# EAGLE design diagrama-esquematico-r00 (EAGLE 8.6.0)
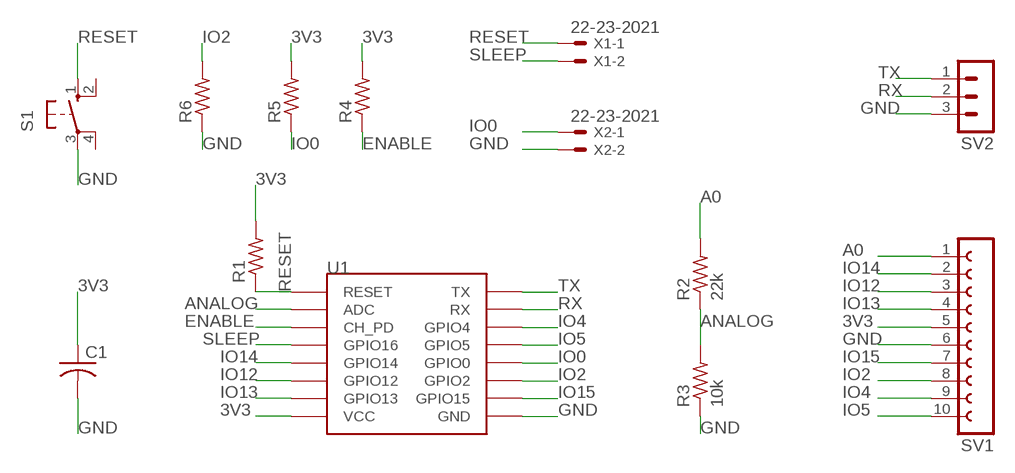
[diagram p0: schematic, sheet 1]

## Parts
C1  C-US025-030X050  [C025-030X050]
R1  R-US_0207/10  [0207/10]
R2  22k  R-US_0207/10  [0207/10]
R3  10k  R-US_0207/10  [0207/10]
R4  R-US_0207/10  [0207/10]
R5  R-US_0207/10  [0207/10]
R6  R-US_0207/10  [0207/10]
S1  10-XX  [B3F-10XX]
SV1  FE10-1  [FE10]
SV2  MA03-1  [MA03-1]
U1  ESP12  [ESP12]
X1  22-23-2021  [22-23-2021]
X2  22-23-2021  [22-23-2021]

## Nets
3V3: C1.1 R1.2 R4.2 R5.2 SV1.5 U1.VCC
A0: R2.2 SV1.1
ANALOG: R2.1 R3.2 U1.ADC
ENABLE: R4.1 U1.CH_PD
GND: C1.2 R3.1 R6.1 S1.3(P) SV1.6 SV2.3 U1.GND X2.2
IO0: R5.1 U1.GPIO0 X2.1
IO2: R6.2 SV1.8 U1.GPIO2
IO4: SV1.9 U1.GPIO4
IO5: SV1.10 U1.GPIO5
IO12: SV1.3 U1.GPIO12
IO13: SV1.4 U1.GPIO13
IO14: SV1.2 U1.GPIO14
IO15: SV1.7 U1.GPIO15
RESET: R1.1 S1.1(S) U1.RESET X1.1
RX: SV2.2 U1.RX
SLEEP: U1.GPIO16 X1.2
TX: SV2.1 U1.TX
Unconnected: S1.2(S1) S1.4(P1)

## Library data of the parts
C1 = rcl:C-US: CAPACITOR, American symbol; SPICEPREFIX: C
R1-R6 = resistor:R-US_: RESISTOR, American symbol
S1 = switch-omron:10-XX: OMRON SWITCH; MPN: B3F-1000; OC_FARNELL: 176432; OC_NEWARK: 36M3542
SV1 = con-lsta:FE10-1: FEMALE HEADER; OC_FARNELL: unknown; OC_NEWARK: unknown
SV2 = con-lstb:MA03-1: PIN HEADER; OC_FARNELL: unknown; OC_NEWARK: unknown
U1 = esp8266modules:ESP12: ESP8266 Wifi module 12
X1 X2 = con-molex:22-23-2021: .100" (2.54mm) Center Header - 2 Pin; MF: MOLEX; MPN: 22-23-2021; OC_FARNELL: 1462926; OC_NEWARK: 25C3832

## Board
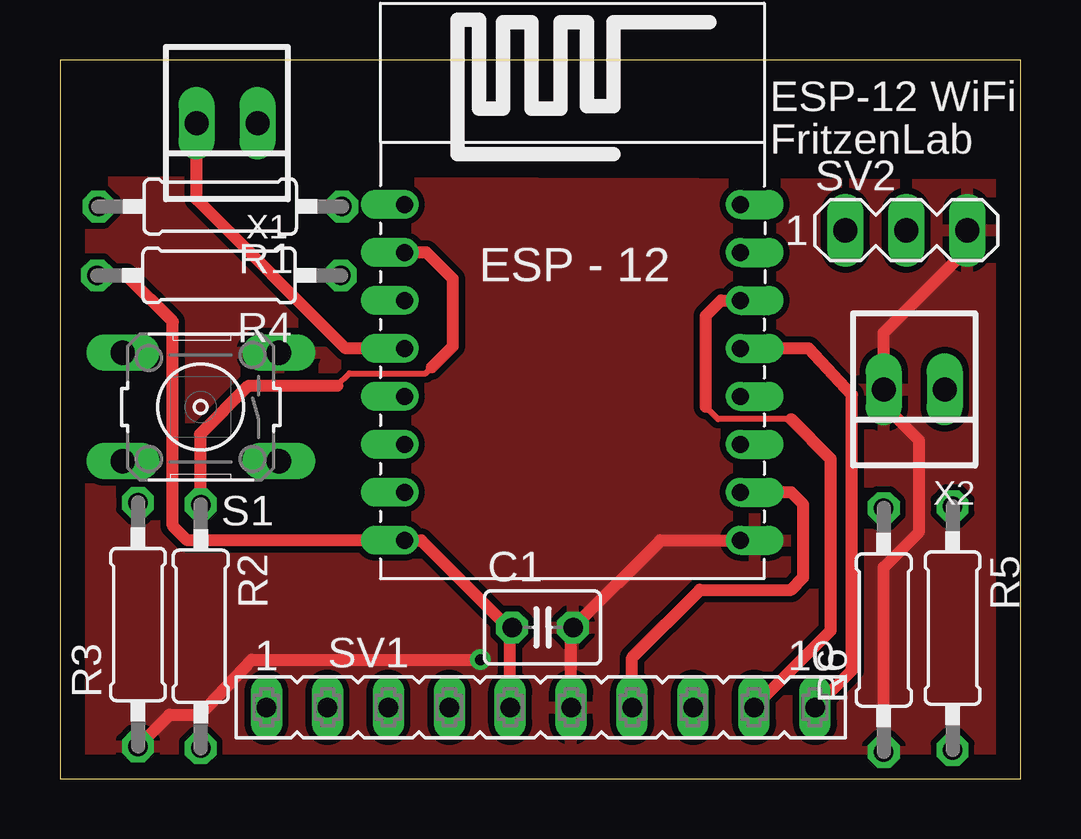
[diagram p1: board, top side]
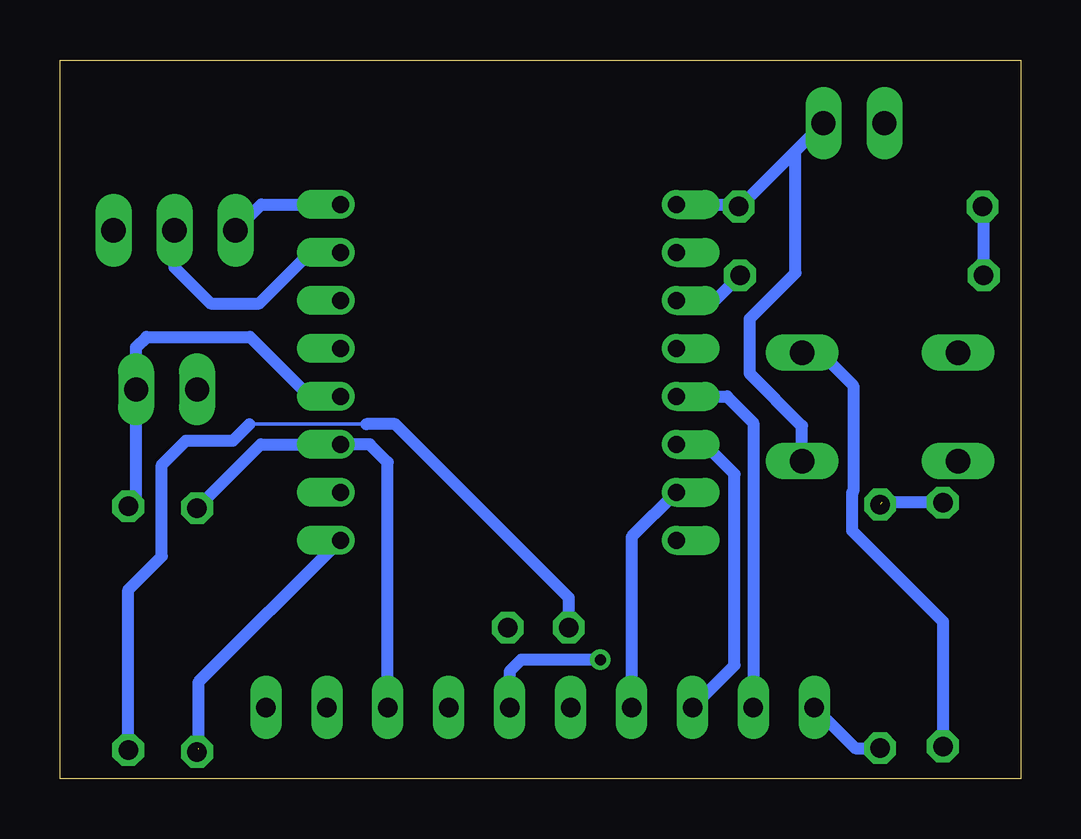
[diagram p2: board, bottom side, seen from below]

Size 40.06 x 29.96 mm. Coordinates in mm from the lower left corner, seen from the top.
Outline: 0,0 40.06,0 40.06,29.96 0,29.96 0,0
Copper layers (1*16): Top 0.035mm / dielectric 1.5mm / Bottom 0.035mm
Design rules "default *": minimum track width 6mil, minimum drill 0.35mm, track to track 10mil, track to pad 10mil, pad to pad 10mil, via to via 10mil, smd to smd 10mil, copper to edge 40mil, drill to drill 6mil, minimum pad ring 10mil, minimum via ring 8mil, stop-mask expansion 4mil, vias tented up to drill 0mil, thermal gap 10mil

### Footprints (pad centres in the part's own frame; a part is rotated, then mirrored left to right if it is on the bottom)
C025-030X050 = drill 0.813 octagon: 1 -1.27,0; 2 1.27,0
0207/10 = drill 0.813 octagon: 1 -5.08,0; 2 5.08,0
B3F-10XX = drill 1.016 long: 1 -3.251,2.261; 2 3.251,2.261; 3 -3.251,-2.261; 4 3.251,-2.261
FE10 = drill 0.813 long: 1 -11.43,0; 2 -8.89,0; 3 -6.35,0; 4 -3.81,0; 5 -1.27,0; 6 1.27,0; 7 3.81,0; 8 6.35,0; 9 8.89,0; 10 11.43,0
MA03-1 = drill 1.016 long: 1 -2.54,0; 2 0,0; 3 2.54,0
ESP12 = drill 0.7 offset: ADC -7.1,3.8; CH_PD -7.1,1.8; GND 6.9,-8.2; GPIO0 6.9,-2.2; GPIO2 6.9,-4.2; GPIO4 6.9,1.8; GPIO5 6.9,-0.2; GPIO12 -7.1,-4.2; GPIO13 -7.1,-6.2; GPIO14 -7.1,-2.2; GPIO15 6.9,-6.2; GPIO16 -7.1,-0.2; RESET -7.1,5.8; RX 6.9,3.8; TX 6.9,5.8; VCC -7.1,-8.2
22-23-2021 = drill 1 long: 1 -1.27,0; 2 1.27,0

### Placement (x,y rotation side)
C1  20.12,6.3 0 top
R1  6.68,23.85 180 top
R2  5.87,6.35 270 top
R3  3.25,6.43 90 top
R4  6.63,20.98 180 top
R5  37.21,6.27 270 top
R6  34.34,6.2 90 top
S1  5.87,15.49 180 top
SV1  20.04,2.97 0 top
SV2  35.28,22.86 0 top
U1  21.46,18.14 0 top
X1  6.96,27.33 180 top
X2  35.61,16.23 180 top

### Tracks (layer width: path | path; a pad name or v marks a point on that pad's centre or on a via)
3V3
  Top 0.152: 1.52,21.03 R4.2 1.68,20.88 | 1.52,23.77 R1.2 | 14.17,10.06 U1.VCC
  Top 0.508: SV1.5 18.77,6.22 | 18.77,6.22 C1.1 | 18.77,6.22 15.06,9.94 U1.VCC 5.3,9.94 4.7,10.54 4.7,19.05 2.77,20.98 R4.2
  Bottom 0.152: 32.16,14.78 27.28,14.78 | 37.19,1.22 R5.2
  Bottom 0.508: C1.1 18.85,7.54 26.09,14.78 27.28,14.78 | R5.2 37.21,7.87 35.81,9.27 35.81,13.08 34.8,14.1 32.84,14.1 32.16,14.78 | R4.2 1.55,23.8 R1.2
A0
  Bottom 0.508: SV1.1 6.91,1.27 R2.2
ANALOG  (1 unrouted)
  Top 0.254: 11.56,16.38 12.06,16.89 15.24,16.89 15.49,17.14
  Top 0.508: R2.1 5.87,14.33 5.84,14.35 7.87,16.38 11.56,16.38 | 15.49,17.14 16.38,18.03 16.38,20.83 15.28,21.94 U1.ADC
  Bottom 0.508: R3.2 5.79,11.51
ENABLE
  Bottom 0.508: U1.CH_PD 12.75,19.94 R4.1
GND  (via drill 0.45)  (1 unrouted)
  Top 0.152: 34.44,16.51 34.44,16.31 X2.2 | 21.18,2.74 SV1.6
  Top 0.508: SV1.6 21.31,6.22 C1.2 25.02,9.94 U1.GND | R6.1 34.34,8.81 35.81,10.29 35.81,14.1 34.44,15.47 34.44,16.51 | X2.2 34.34,18.59 37.82,22.07 SV2.3 | R3.1 4.57,2.67 5.84,2.67 8,4.95 v17.53,4.95
  Bottom 0.152: 3.35,1.37 R3.1 | 34.29,1.22 R6.1 | 28.5,9.91 U1.GND
  Bottom 0.508: U1.GND 34.29,4.01 34.29,1.27 | R3.1 3.25,6.55 7.04,10.34 7.04,11.91 6.99,11.96 6.99,16.38 8.36,17.75 S1.3 | v17.53,4.95 20.83,4.95 21.31,4.47 SV1.6
  pour Top: 0,0 -0.13,24.89 40.01,24.77 40.01,-0.13 0.13,-0.13
IO0
  Bottom 0.508: U1.GPIO0 29.65,15.94 32.13,18.41 36.45,18.41 36.88,17.98 X2.1 36.88,11.68 R5.1
IO2
  Bottom 0.508: R6.2 31.68,13.94 U1.GPIO2 27.14,13.94 26.39,13.18 SV1.8
IO4
  Top 0.254: 26.92,15.49 27.43,14.99 30.48,14.99
  Top 0.508: SV1.9 32.13,6.17 32.13,13.34 30.48,14.99 | 26.92,15.49 26.92,19.3 27.56,19.94 U1.GPIO4
IO5
  Top 0.508: SV1.10 33.02,4.52 33.02,16 31.21,17.94 U1.GPIO5
IO12
  Bottom 0.508: SV1.3 11.94,4.72 11.94,12.7 13.17,13.94 U1.GPIO12
IO13
  Bottom 0.508: U1.GPIO13 16.23,10.07 SV1.4
IO14
  Bottom 0.508: U1.GPIO14 12.25,15.94 11.15,14.83 SV1.2
IO15
  Top 0.508: SV1.7 23.85,5.05 26.67,7.87 30.48,7.87 30.99,8.38 30.99,11.43 30.48,11.94 U1.GPIO15
RESET
  Bottom 0.508: U1.RESET 11.85,23.94 | 11.85,23.94 R1.1 | X1.1 9.4,26.16 | 9.4,26.16 11.62,23.94 11.85,23.94 | S1.1 9.12,14.71 11.3,16.89 11.3,19.18 9.4,21.08 9.4,26.16
RX
  Bottom 0.508: SV2.2 35.28,21.31 33.78,19.81 31.75,19.81 29.63,21.94 U1.RX
SLEEP
  Top 0.508: U1.GPIO16 11.91,17.94 5.69,24.16 X1.2
TX
  Bottom 0.508: SV2.1 31.66,23.94 U1.TX

### Text on the board
tNames: ESP-12 WiFi | FritzenLab
tValues: A0 | 14 | 12 | 13 | 3V3 | GND | 15 | 2 | 4 | 5